# EAGLE design Sensor_board (EAGLE 7.7.0)
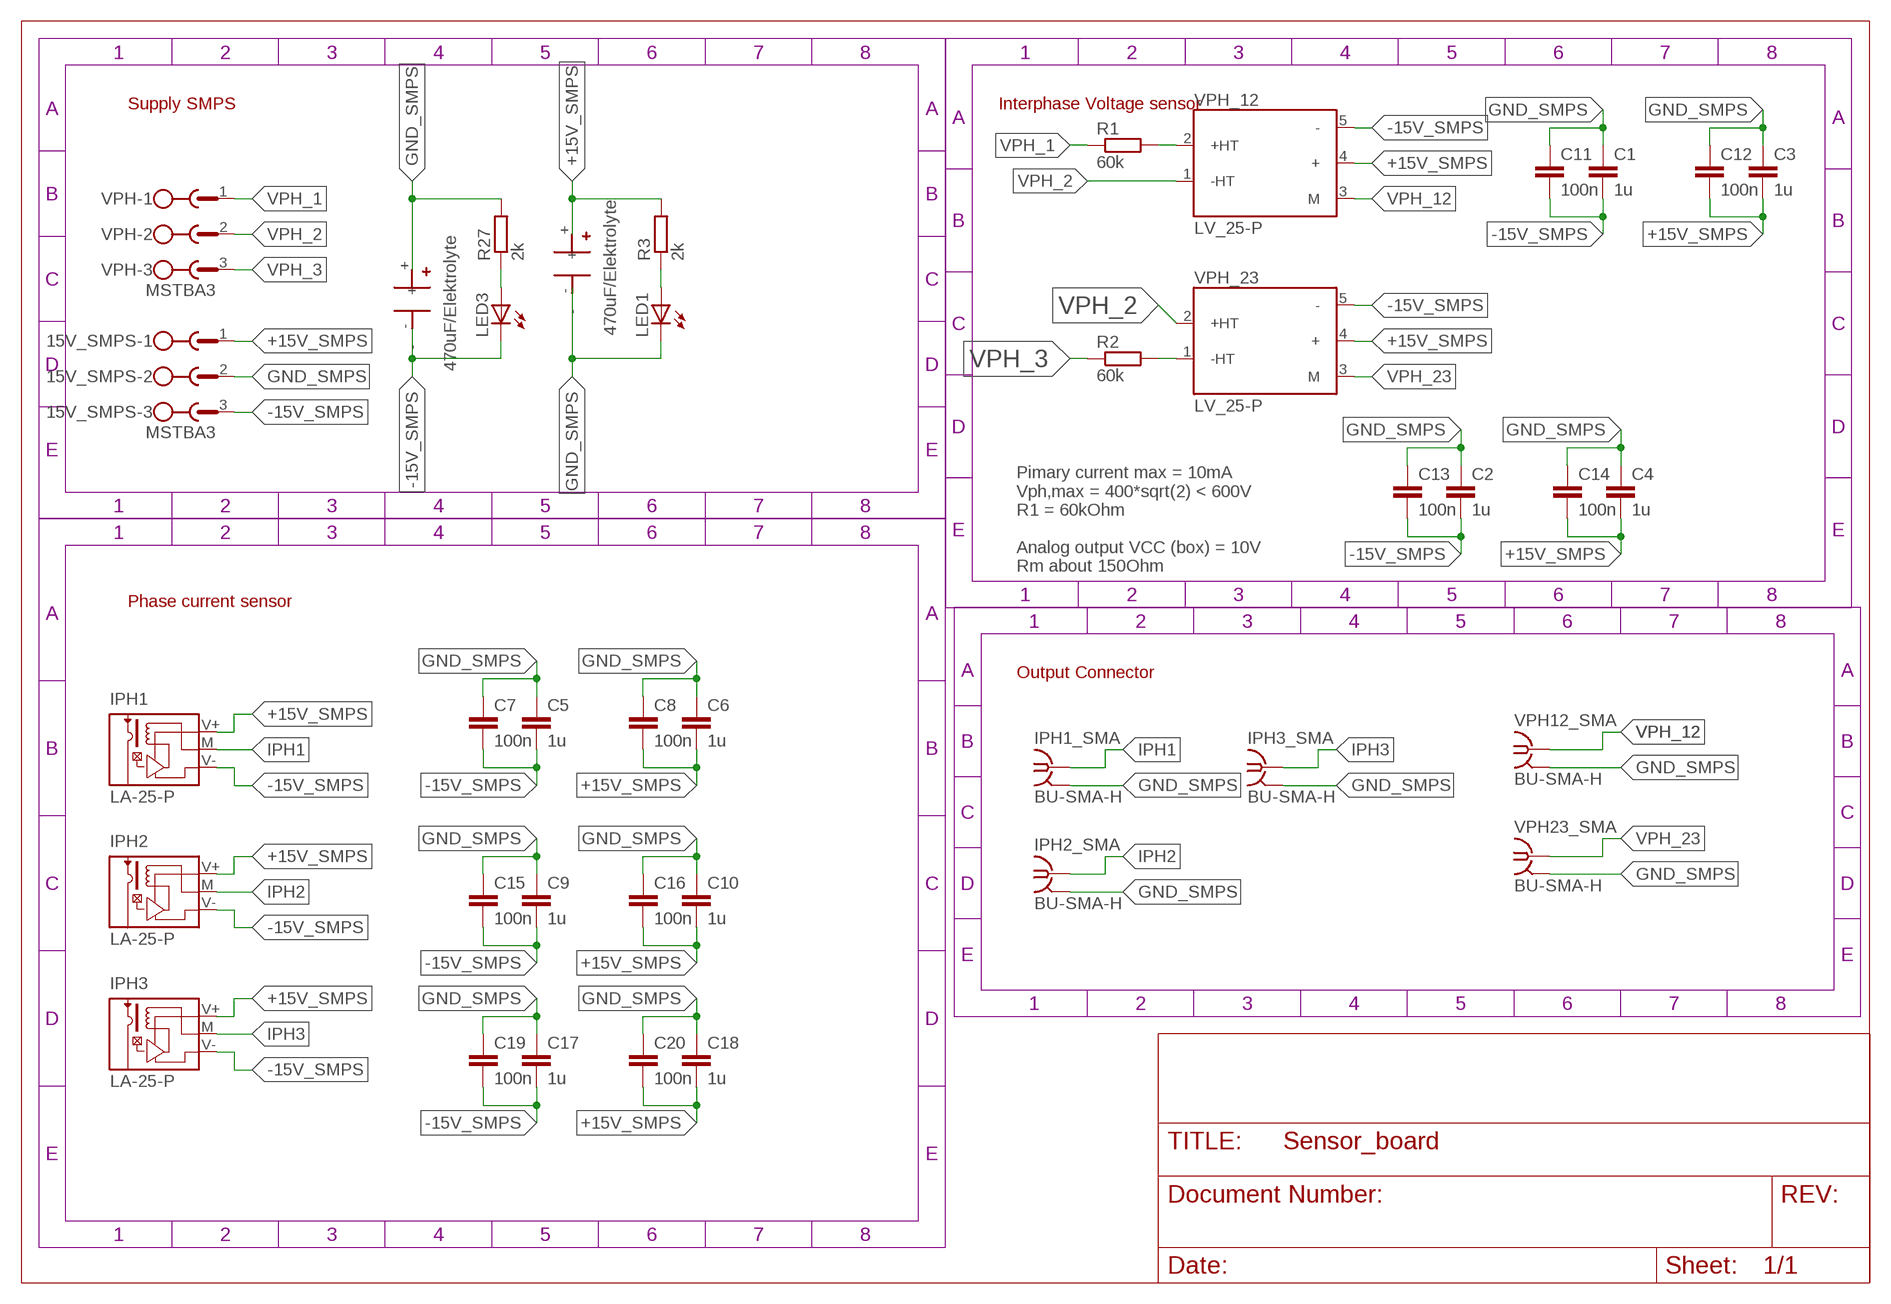
[diagram p0: schematic, sheet 1]

## Parts
15V_SMPS  MSTBA3  [MSTBA3]
C1  1u  C-EUC0805  [C0805]
C2  1u  C-EUC0805  [C0805]
C3  1u  C-EUC0805  [C0805]
C4  1u  C-EUC0805  [C0805]
C5  1u  C-EUC0805  [C0805]
C6  1u  C-EUC0805  [C0805]
C7  100n  C-EUC0805  [C0805]
C8  100n  C-EUC0805  [C0805]
C9  1u  C-EUC0805  [C0805]
C10  1u  C-EUC0805  [C0805]
C11  100n  C-EUC0805  [C0805]
C12  100n  C-EUC0805  [C0805]
C13  100n  C-EUC0805  [C0805]
C14  100n  C-EUC0805  [C0805]
C15  100n  C-EUC0805  [C0805]
C16  100n  C-EUC0805  [C0805]
C17  1u  C-EUC0805  [C0805]
C18  1u  C-EUC0805  [C0805]
C19  100n  C-EUC0805  [C0805]
C20  100n  C-EUC0805  [C0805]
IPH1  LA-25-P  [LA25P]
IPH1_SMA  BU-SMA-H  [BU-SMA-H]
IPH2  LA-25-P  [LA25P]
IPH2_SMA  BU-SMA-H  [BU-SMA-H]
IPH3  LA-25-P  [LA25P]
IPH3_SMA  BU-SMA-H  [BU-SMA-H]
LED1  LEDCHIPLED_0805  [CHIPLED_0805]
LED3  LEDCHIPLED_0805  [CHIPLED_0805]
R1  60k  R-EU_0414/15  [0414/15]
R2  60k  R-EU_0414/15  [0414/15]
R3  2k  R-EU_R0805  [R0805]
R27  2k  R-EU_R0805  [R0805]
U$1  ELE_C_470UF_PAN  [ELEK_C_470UF_PAN]
U$2  ELE_C_470UF_PAN  [ELEK_C_470UF_PAN]
VPH  MSTBA3  [MSTBA3]
VPH12_SMA  BU-SMA-H  [BU-SMA-H]
VPH23_SMA  BU-SMA-H  [BU-SMA-H]
VPH_12  LV_25-P  [XDCR_LV25-P]
VPH_23  LV_25-P  [XDCR_LV25-P]

## Nets
+15V_SMPS: 15V_SMPS.1 C3.2 C4.2 C6.2 C8.2 C10.2 C12.2 C14.2 C16.2 C18.2 C20.2 IPH1.V+ IPH2.V+ IPH3.V+ R3.2 U$2.+ VPH_12.4(+) VPH_23.4(+)
-15V_SMPS: 15V_SMPS.3 C1.2 C2.2 C5.2 C7.2 C9.2 C11.2 C13.2 C15.2 C17.2 C19.2 IPH1.V- IPH2.V- IPH3.V- LED3.C U$1.- VPH_12.5(-) VPH_23.5(-)
GND_SMPS: 15V_SMPS.2 C1.1 C2.1 C3.1 C4.1 C5.1 C6.1 C7.1 C8.1 C9.1 C10.1 C11.1 C12.1 C13.1 C14.1 C15.1 C16.1 C17.1 C18.1 C19.1 C20.1 IPH1_SMA.2 IPH1_SMA.3 IPH1_SMA.4 IPH1_SMA.5 IPH2_SMA.2 IPH2_SMA.3 IPH2_SMA.4 IPH2_SMA.5 IPH3_SMA.2 IPH3_SMA.3 IPH3_SMA.4 IPH3_SMA.5 LED1.C R27.2 U$1.+ U$2.- VPH12_SMA.2 VPH12_SMA.3 VPH12_SMA.4 VPH12_SMA.5 VPH23_SMA.2 VPH23_SMA.3 VPH23_SMA.4 VPH23_SMA.5
IPH1: IPH1.M IPH1_SMA.1
IPH2: IPH2.M IPH2_SMA.1
IPH3: IPH3.M IPH3_SMA.1
N$1: R1.2 VPH_12.2(+HT)
N$2: R2.2 VPH_23.1(-HT)
N$3: LED1.A R3.1
N$12: LED3.A R27.1
VPH_1: R1.1 VPH.1
VPH_2: VPH.2 VPH_12.1(-HT) VPH_23.2(+HT)
VPH_3: R2.1 VPH.3
VPH_12: VPH12_SMA.1 VPH_12.3(M)
VPH_23: VPH23_SMA.1 VPH_23.3(M)

## Notes on the sheet
- Supply SMPS | Interphase Voltage sensor
- Pimary current max = 10mA
  Vph,max = 400*sqrt(2) < 600V
  R1 = 60kOhm
  
  Analog output VCC (box) = 10V
  Rm about 150Ohm
- Phase current sensor
- Output Connector

## Library data of the parts
15V_SMPS VPH = con-phoenix-508:MSTBA3: PHOENIX; MF: FARNELL; MPN: 1757255; OC_FARNELL: 3705183; OC_NEWARK: 71C4162
C1-C20 = rcl:C-EU: CAPACITOR, European symbol
IPH1-IPH3 = lem:LA-*: Current Transducer LA 100P For the electronic measurement of currents: DC, AC, pulsed..., Source: Data sheet <http://www.lem.com/docs/products/la%20100-p%20e.pdf>
IPH1_SMA IPH2_SMA IPH3_SMA VPH12_SMA VPH23_SMA = con-coax:BU-SMA-H: FEMALE SMA CONNECTOR Radiall; OC_FARNELL: unknown; OC_NEWARK: unknown
LED1 LED3 = led:LED: LED OSRAM: - CHIPLED LG R971, LG N971, LY N971, LG Q971, LY Q971, LO R971, LY R971 LH N974, LH R974 LS Q976, LO Q976, LY Q976 LO Q996 - Hyper CHIPLED LW Q18S LB Q993, LB Q99A, LB R99A - SideLED LS A670, LO A670, LY A670, LG A670, LP A670 LB A673, LV A673, LT A673, LW A673 LH A674 LY A675 LS A676, LA A676, LO A676, LY A676, LW A676 LS A679, LY A679, LG A679 - Hyper Micro SIDELED® LS Y876, LA Y876, LO Y876, LY Y876 LT Y87S - SmartLED LW L88C, LW L88S LB L89C, LB L89S, LG L890 LS L89K, LO L89K, LY L89K LS L896, LA L896, LO L896, LY L896 - TOPLED LS T670, LO T670, LY T670, LG T670, LP T670 LSG T670, LSP T670, LSY T670, LOP T670, LYG T670 LG T671, LOG T671, LSG T671 LB T673, LV T673, LT T673, LW T673 LH T674 LS T676, LA T676, LO T676, LY T676, LB T676, LH T676, LSB T676, LW T676 LB T67C, LV T67C, LT T67C, LS T67K, LO T67K, LY T67K, LW E67C LS E67B, LA E67B, LO E67B, LY E67B, LB E67C, LV E67C, LT E67C LW T67C LS T679, LY T679, LG T679 LS T770, LO T770, LY T770, LG T770, LP T770 LB T773, LV T773, LT T773, LW T773 LH T774 LS E675, LA E675, LY E675, LS T675 LS T776, LA T776, LO T776, LY T776, LB T776 LHGB T686 LT T68C, LB T68C - Hyper Mini TOPLED® LB M676 - Mini TOPLED Santana® LG M470 LS M47K, LO M47K, LY M47K Source: http://www.osram.convergy.de LUXEON: - LUMILED® LXK2-PW12-R00, LXK2-PW12-S00, LXK2-PW14-U00, LXK2-PW14-V00 LXK2-PM12-R00, LXK2-PM12-S00, LXK2-PM14-U00 LXK2-PE12-Q00, LXK2-PE12-R00, LXK2-PE12-S00, LXK2-PE14-T00, LXK2-PE14-U00 LXK2-PB12-K00, LXK2-PB12-L00, LXK2-PB12-M00, LXK2-PB14-N00, LXK2-PB14-P00, LXK2-PB14-Q00 LXK2-PR12-L00, LXK2-PR12-M00, LXK2-PR14-Q00, LXK2-PR14-R00 LXK2-PD12-Q00, LXK2-PD12-R00, LXK2-PD12-S00 LXK2-PH12-R00, LXK2-PH12-S00 LXK2-PL12-P00, LXK2-PL12-Q00, LXK2-PL12-R00 Source: www.luxeon.com KINGBRIGHT: KA-3528ASYC Source: www.kingbright.com
R1-R3 R27 = rcl:R-EU_: RESISTOR, European symbol
U$1 U$2 = Submodule:ELE_C_470UF_PAN
VPH_12 VPH_23 = LV_25-P:LV_25-P: Transducer Voltage Close Loop 10ma - Lv 25-p; DESCRIPTION: Current transformer [LEM] LV 25-P Current transformer; DIGI-KEY_PART_NUMBER: 398-1019-ND; DIGI-KEY_PURCHASE_URL: https://www.digikey.com/product-detail/en/lem-usa-inc/LV-25-P/398-1019-ND/409832?utm_source=snapeda&utm_medium=aggregator&utm_campaign=symbol; MF: LEM USA; MP: LV 25-P; PACKAGE: TSSOP-14 LEM

## Board
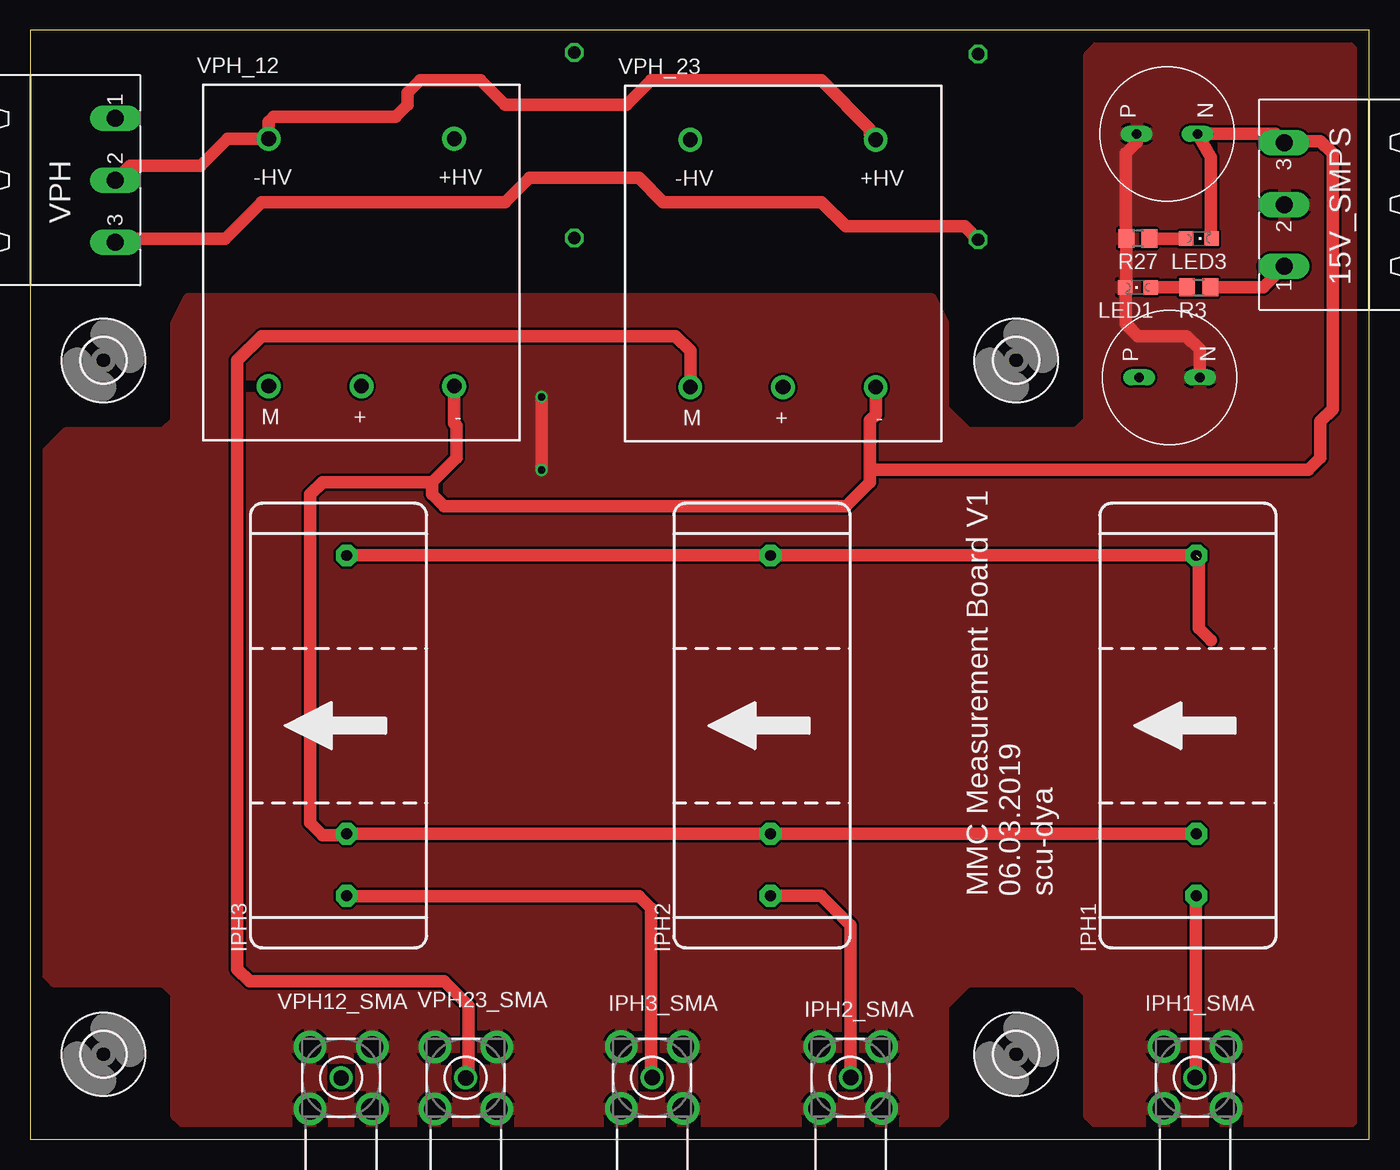
[diagram p1: board, top side]
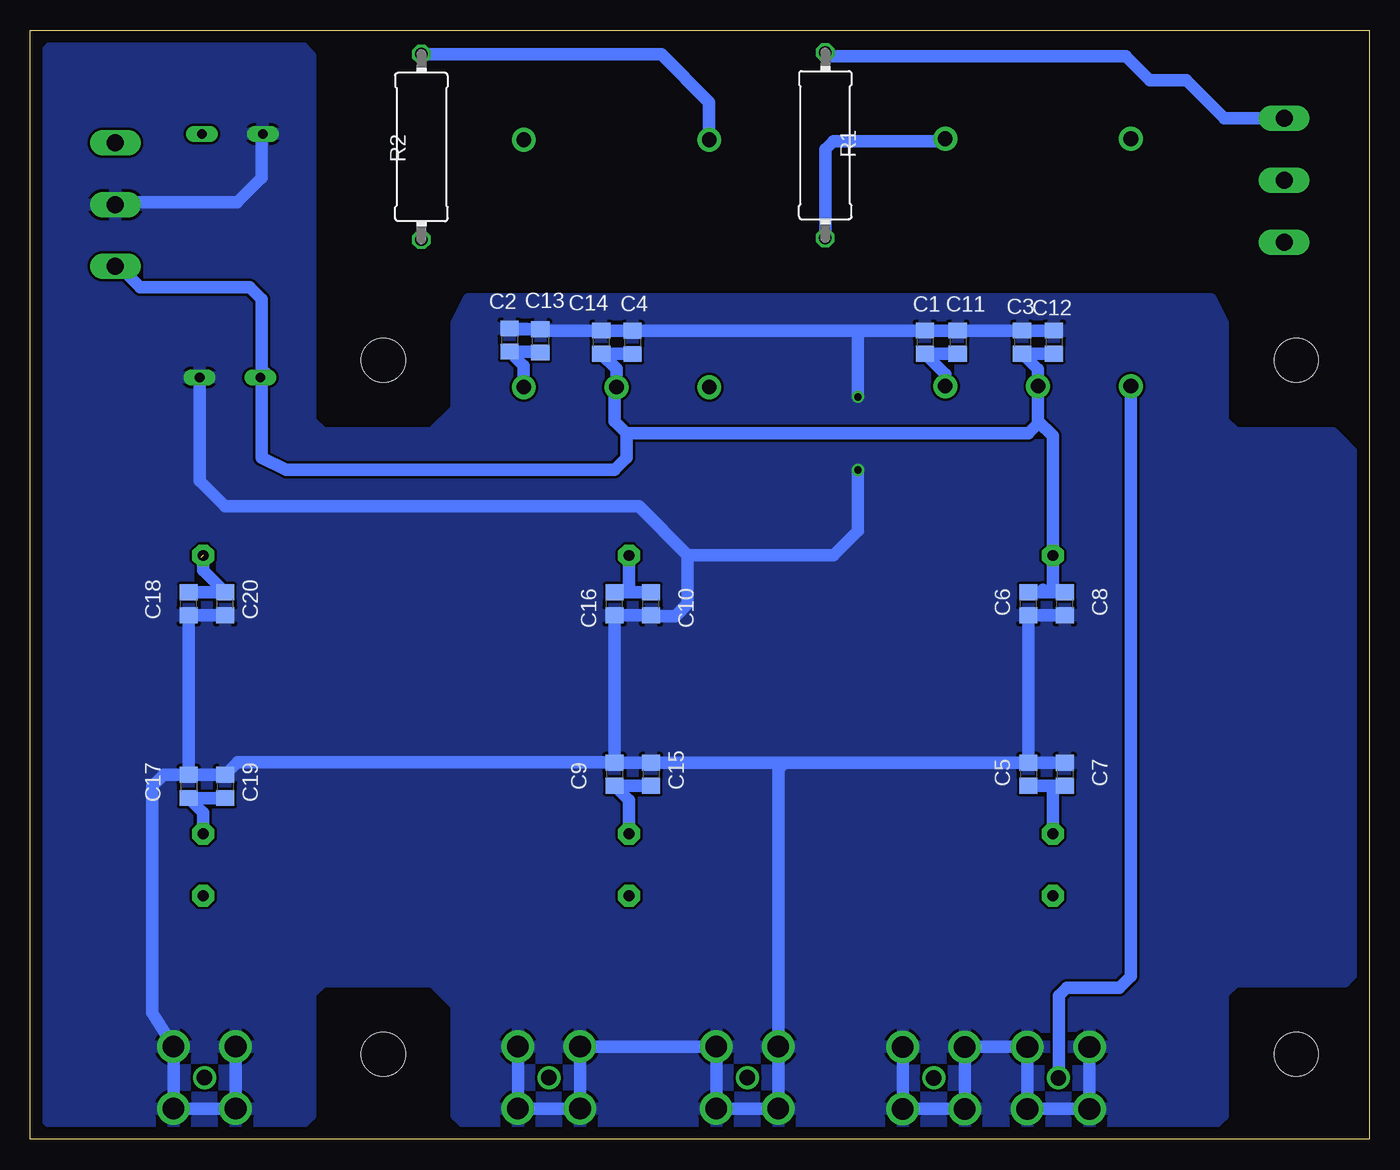
[diagram p2: board, bottom side, seen from below]

Size 110 x 91.1 mm. Coordinates in mm from the lower left corner, seen from the top.
Outline: 0,0 110,0 110,91.1 0,91.1 0,0
Copper layers (1*16): Top 0.035mm / dielectric 1.5mm / Bottom 0.035mm
Design rules "default": minimum track width 10mil, minimum drill 24mil, track to track 8mil, track to pad 8mil, pad to pad 8mil, via to via 8mil, smd to smd 8mil, copper to edge 40mil, drill to drill 8mil, minimum pad ring 10mil, minimum via ring 8mil, stop-mask expansion 4mil, vias tented up to drill 0mil, thermal gap 10mil

### Footprints (pad centres in the part's own frame; a part is rotated, then mirrored left to right if it is on the bottom)
MSTBA3 = drill 1.397 long: 1 -5.08,5.08; 2 0,5.08; 3 5.08,5.08
C0805 = smd 1.3 x 1.5: 1 -0.95,0; 2 0.95,0
LA25P = drill 0.9 pad 1.8 octagon: M -13.97,0; V+ 13.97,0; V- -8.89,0
BU-SMA-H = drill 1.27: 1 0,0 | drill 1.778: 2 -2.55,2.55; 3 2.55,2.55; 4 2.55,-2.55; 5 -2.55,-2.55
CHIPLED_0805 = smd 1.2 x 1.2: A 0,-1.05; C 0,1.05
0414/15 = drill 1.016 octagon: 1 -7.62,0; 2 7.62,0
R0805 = smd 1.3 x 1.5: 1 -0.95,0; 2 0.95,0
ELEK_C_470UF_PAN = drill 0.8 long: + 0,2.5; - 0,-2.5
3,6 = hole 3.6: 0,0
XDCR_LV25-P = drill 1.2 pad 1.962: 1 -7.62,10.16; 2 7.62,10.16; 3 -7.62,-10.16; 4 0,-10.16; 5 7.62,-10.16

### Placement (x,y rotation side)
15V_SMPS  108.1,76.8 90 top
C1  36.5,65.5 270 bottom
C2  70.63,65.67 270 bottom
C3  28.5,65.5 270 bottom
C4  60.53,65.47 270 bottom
C5  28,30 270 bottom
C6  28,44 90 bottom
C7  25,30 270 bottom
C8  25,44 90 bottom
C9  62,30 270 bottom
C10  59,44 90 bottom
C11  33.8,65.5 270 bottom
C12  25.9,65.5 270 bottom
C13  68.1,65.6 270 bottom
C14  63.1,65.5 270 bottom
C15  59,30 270 bottom
C16  62,44 90 bottom
C17  97,29 270 bottom
C18  97,44 90 bottom
C19  94,29 270 bottom
C20  94,44 90 bottom
IPH1  95.8,34 90 top
IPH1_SMA  95.69,5.08 270 top
IPH2  60.8,34 90 top
IPH2_SMA  67.39,5.08 270 top
IPH3  26,34 90 top
IPH3_SMA  51.09,5.08 270 top
LED1  91,70 90 top
LED3  96,74 270 top
R1  44.68,81.67 270 bottom
R2  77.87,81.53 90 bottom
R3  96,70 0 top
R27  91,74 180 top
U$1  93.4,82.6 90 top
U$2  93.6,62.6 90 top
U$4  [3,6]  81,64 0 top
U$5  [3,6]  81,7 0 top
U$8  [3,6]  6,7 0 top
U$12  [3,6]  6,64 0 top
VPH  1.9,78.8 270 top
VPH12_SMA  25.53,5.06 270 top
VPH23_SMA  35.77,5.06 270 top
VPH_12  27.2,72.04 0 top
VPH_23  61.84,71.96 0 top

### Tracks (layer width: path | path; a pad name or v marks a point on that pad's centre or on a via)
+15V_SMPS  (1 unrouted)
  Top 1.016: 97,41 96,42 96,47.77 | R3.2 101.3,70 15V_SMPS.1 | IPH3.V+ IPH2.V+ IPH1.V+ 95.77,48
  Bottom 1.016: C12.2 C3.2 27.2,63.25 VPH_12.4 27.2,59 | C4.2 60.56,64.55 C14.2 61.84,63.29 VPH_23.4 62,61.64 62,59 61,58 | IPH1.V+ 95.8,46.75 C20.2 C18.2 | C10.2 61,44.95 | 61,44.95 C16.2 | IPH2.V+ 60.8,45.15 61,44.95 | 26,44.95 C8.2 24.95,45 | 26,44.95 27,44.95 | 27,44.95 C6.2 | 26.8,45.15 27,44.95 | 26,44.95 IPH3.V+ 26,57.8 27.2,59 | 27.2,59 27.2,58.8 28,58 61,58 | 15V_SMPS.1 102.72,71.72 101,70 92,70 91,69 91,62.7 U$2.+ | 90.7,63 U$2.+ | U$2.+ 91,62.5 91,56 89,55 62,55 61,56 61,58
-15V_SMPS
  Top 1.016: LED3.C 97,74.05 97,80.7 U$1.- | 60.91,25 IPH2.V- | VPH_12.5 34.82,58.82 35,58.64 35,56 33,54 | U$1.- 102.3,82.6 15V_SMPS.3 103.14,82 106,82 107,81 107,60 106,59 106,56 105,55 69,55 | 96,82.7 U$1.- | 26.11,25 IPH3.V- | VPH_23.5 69.46,59.54 69,59.08 69,55 | IPH3.V- IPH2.V- | IPH2.V- IPH1.V- | IPH3.V- 25.89,25 24,25 23,26 23,53 24,54 33,54 | 33,54 33,53 34,52 67,52 69,54 69,55
  Bottom 1.016: VPH_12.5 34.82,62.87 C1.2 C11.2 | VPH_23.5 69.46,63.55 C2.2 68.17,64.72 C13.2 | C19.2 C17.2 95.8,26.85 IPH1.V- 95.91,25 | C15.2 C9.2 60.8,27.85 IPH2.V- | 60.69,25 IPH2.V- | 60.91,25 IPH2.V- | C7.2 26,29.05 | 26,29.05 C5.2 | IPH3.V- 26,29.05
GND_SMPS  (via drill 0.6)
  Top 1.016: 89.9,74.15 90,74.05 | 90,74.05 90,81 90.9,81.9 U$1.+ | 90,74.05 R27.2 90.05,70.1 LED1.C 90,69.95 90,67 91,66 95,66 96.1,64.9 U$2.- | v42,55 v42,61
  Bottom 1.016: C12.1 C3.1 C11.1 C1.1 36.53,66.42 42,66.42 | C2.1 70.56,66.55 C13.1 68,66.45 C14.1 63.07,66.42 C4.1 42,66.42 | C20.1 C18.1 C17.1 | C17.1 C19.1 92.95,31 62,31 | 62,31 C16.1 C10.1 58.95,43 57,43 56,44 56,48 | 62,31 C9.1 C15.1 48,30.95 | C7.1 C5.1 | C8.1 C6.1 | C6.1 C5.1 | 22.98,7 VPH12_SMA.4 VPH12_SMA.3 VPH12_SMA.2 VPH23_SMA.5 VPH23_SMA.4 VPH23_SMA.3 VPH23_SMA.2 | 22.98,7 VPH12_SMA.5 | IPH2_SMA.2 IPH2_SMA.3 IPH2_SMA.4 IPH2_SMA.5 64.82,7.61 53.66,7.61 IPH3_SMA.2 IPH3_SMA.3 IPH3_SMA.4 IPH3_SMA.5 48.54,30.41 48,30.95 | IPH1_SMA.2 IPH1_SMA.3 IPH1_SMA.4 IPH1_SMA.5 | 28.05,43 C6.1 | 98.26,7.61 IPH1_SMA.2 | 15V_SMPS.2 104,76.8 103.8,77 93,77 91,79 91,82.5 U$1.+ | v42,61 42,66.42 | 23,7.02 22.98,7 | C5.1 48,30.95 | C17.1 99.05,29.95 100,29 100,10.39 IPH1_SMA.2 | v42,55 42,50 44,48 56,48 | 56,48 60,52 94,52 96.1,54.1 U$2.-
  pour Bottom: 2,13 11,13 12,12 12,2 13,1 74,1 75,2 75,11 77,13 86,13 87,12 87,2 88,1 108,1 109,2 109,89 108,90 88,90 87,89 87,59 86,58 77,58 75,60 75,67 74,69 13,69 12,67 12,59 11,58 3,58 1,56 1,14
  pour Top: 2,13 11,13 12,12 12,2 13,1 74,1 75,2 75,11 77,13 86,13 87,12 87,2 88,1 108,1 109,2 109,89 108,90 88,90 87,89 87,59 86,58 77,58 75,60 75,67 74,69 13,69 12,67 12,59 11,58 3,58 1,56 1,14
IPH1
  Top 1.016: IPH1.M 95.77,20 95.77,5.16 IPH1_SMA.1
IPH2
  Top 1.016: IPH2_SMA.1 67.39,17.61 64.97,20.03 IPH2.M
IPH3
  Top 1.016: IPH3_SMA.1 51,5.17 51,19 50,20 26.03,20 IPH3.M
N$1
  Bottom 1.016: R1.2 44.68,81.32 44,82 35.02,82 VPH_12.2
N$2
  Bottom 1.016: VPH_23.1 54.22,85.22 58.15,89.15 R2.2
N$3
  Top 1.016: LED1.A R3.1
N$12
  Top 1.016: LED3.A R27.1
VPH_1
  Bottom 1.016: VPH.1 11.88,83.88 15,87 18,87 20,89 44.39,89 R1.1
VPH_2
  Top 1.016: VPH.2 8.18,80 14,80 16.2,82.2 VPH_12.1 19.58,83.58 20,84 30,84 31,85 31,86 32,87 37,87 39,85 49,85 51,87 65,87 69,83 69,82.58 VPH_23.2
VPH_3
  Top 1.016: VPH.3 7.26,74 16,74 19,77 39,77 41,79 50,79 52,77 65,77 67,75 76.78,75 R2.1
VPH_12
  Bottom 1.016: VPH_12.3 19.58,13.42 20.53,12.47 24.83,12.47 25.5,11.8 25.5,5.09 VPH12_SMA.1
VPH_23
  Top 1.016: VPH_23.3 54.22,64.78 53,66 19,66 17,64 17,14 18,13 34,13 36,11 36,5.29 VPH23_SMA.1

### Text on the board
tNames: MMC Measurement Board V1 / 06.03.2019 / scu-dya